# EAGLE schematic Module_BaseBoard (EAGLE 9.2.1)

## Sheet 1 of 5: CM5 MODULE
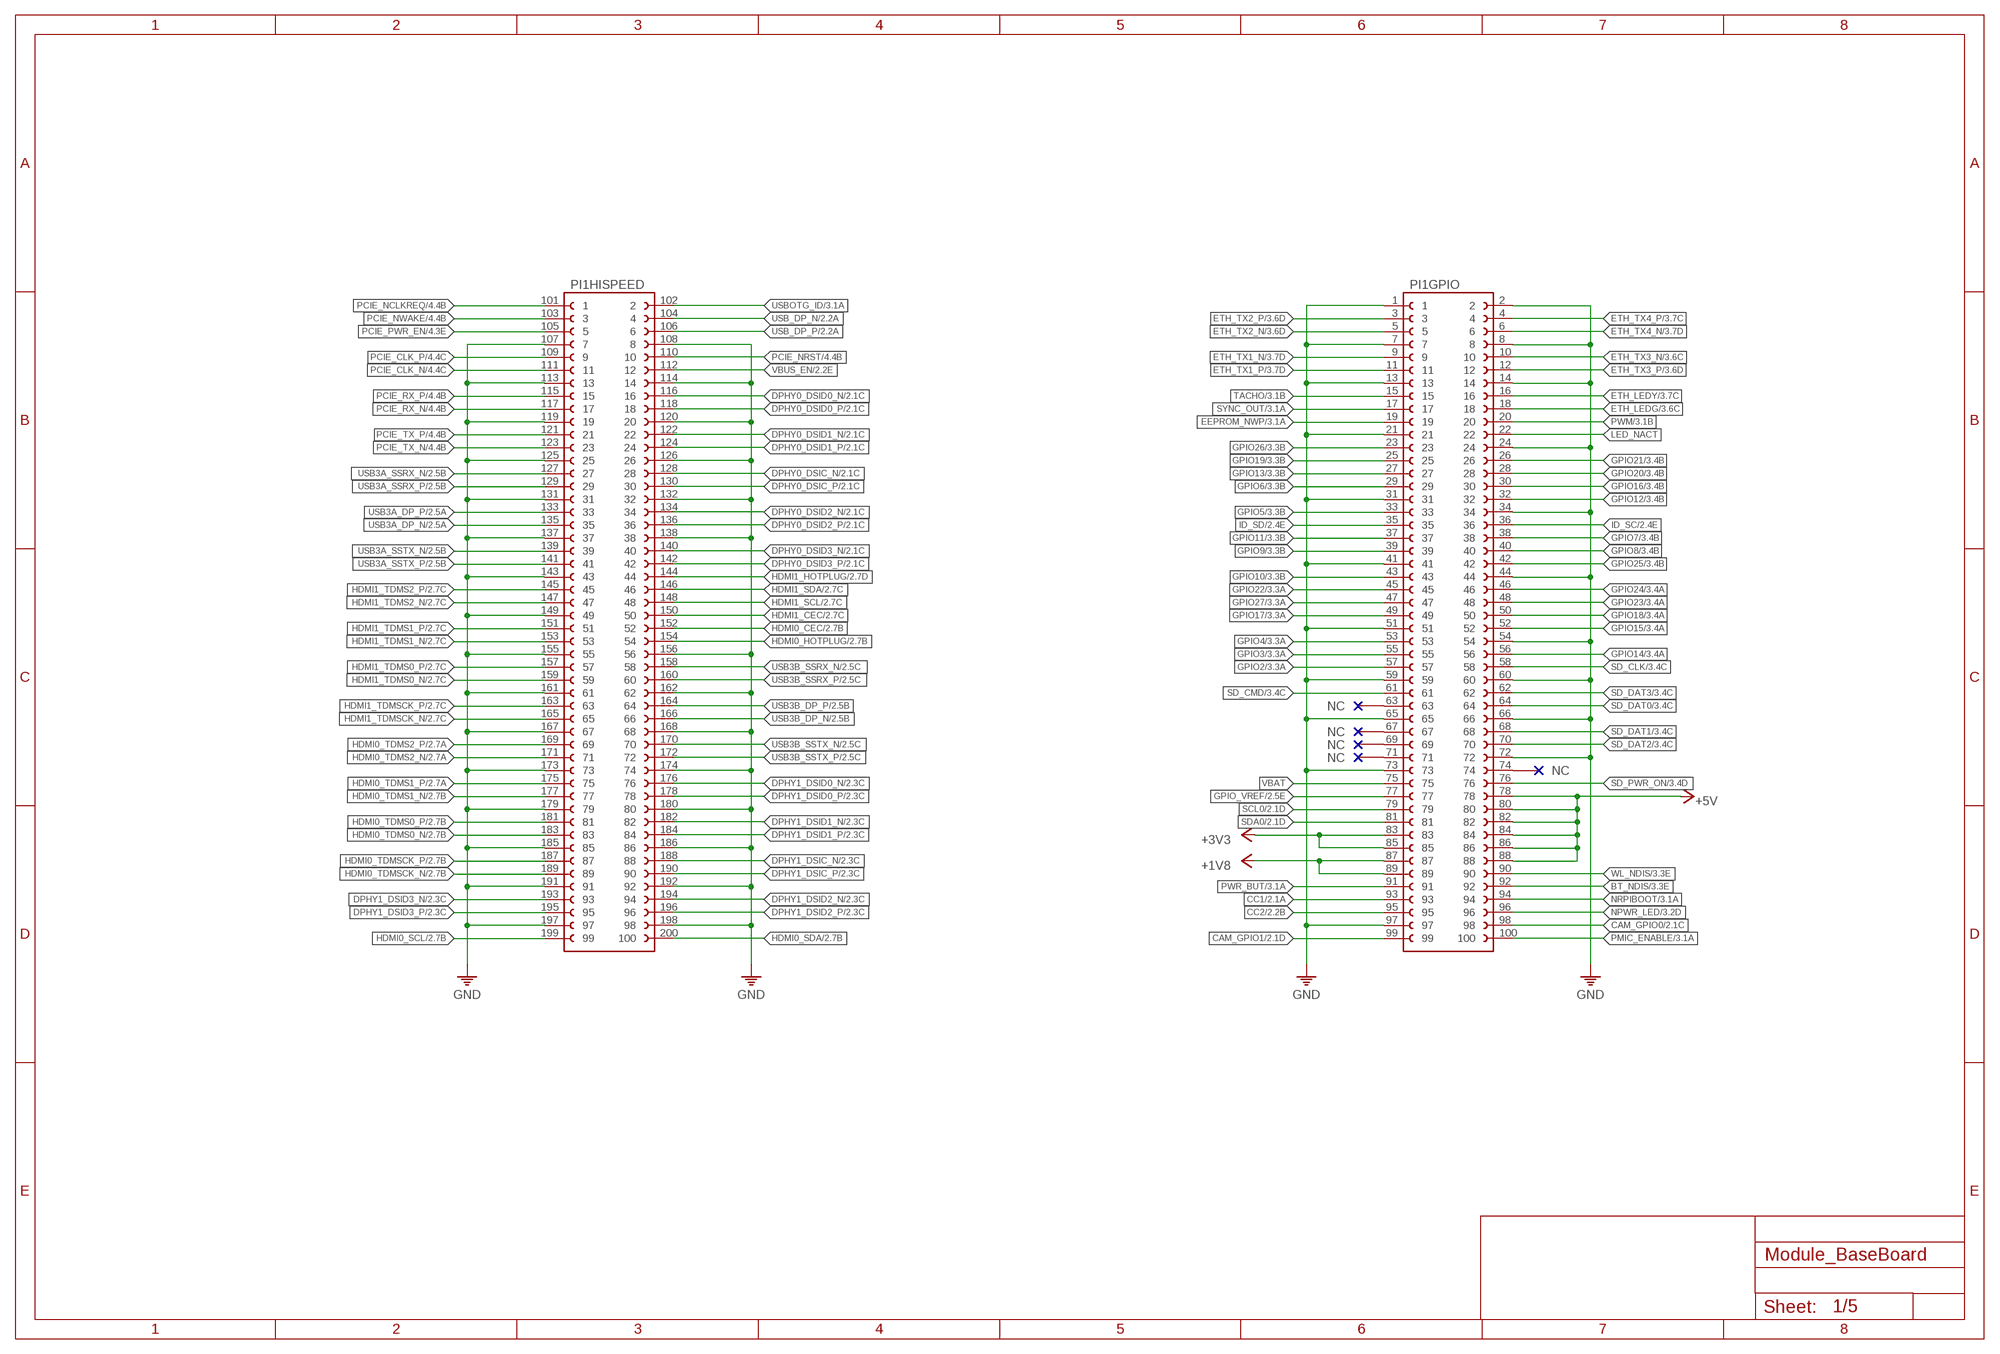
[diagram p0: schematic, sheet 1]

### Parts
PI1  RASPBERRY_CM5  [CM5]

### Nets
+1V8: PI1.87 PI1.89 ; also sheet 3
+3V3: PI1.83 PI1.85 ; also sheet 2,3,4,5
+5V: PI1.78 PI1.80 PI1.82 PI1.84 PI1.86 PI1.88 ; also sheet 2,3,4,5
BT_NDIS: PI1.92 ; also sheet 3
CAM_GPIO0: PI1.98 ; also sheet 2
CAM_GPIO1: PI1.99 ; also sheet 2
CC1: PI1.93 ; also sheet 2
CC2: PI1.95 ; also sheet 2
DPHY0_DSIC_N [100R_DIFFPAIR]: PI1.128 ; also sheet 2
DPHY0_DSIC_P [100R_DIFFPAIR]: PI1.130 ; also sheet 2
DPHY0_DSID0_N [100R_DIFFPAIR]: PI1.116 ; also sheet 2
DPHY0_DSID0_P [100R_DIFFPAIR]: PI1.118 ; also sheet 2
DPHY0_DSID1_N [100R_DIFFPAIR]: PI1.122 ; also sheet 2
DPHY0_DSID1_P [100R_DIFFPAIR]: PI1.124 ; also sheet 2
DPHY0_DSID2_N [100R_DIFFPAIR]: PI1.134 ; also sheet 2
DPHY0_DSID2_P [100R_DIFFPAIR]: PI1.136 ; also sheet 2
DPHY0_DSID3_N [100R_DIFFPAIR]: PI1.140 ; also sheet 2
DPHY0_DSID3_P [100R_DIFFPAIR]: PI1.142 ; also sheet 2
DPHY1_DSIC_N [100R_DIFFPAIR]: PI1.188 ; also sheet 2
DPHY1_DSIC_P [100R_DIFFPAIR]: PI1.190 ; also sheet 2
DPHY1_DSID0_N [100R_DIFFPAIR]: PI1.176 ; also sheet 2
DPHY1_DSID0_P [100R_DIFFPAIR]: PI1.178 ; also sheet 2
DPHY1_DSID1_N [100R_DIFFPAIR]: PI1.182 ; also sheet 2
DPHY1_DSID1_P [100R_DIFFPAIR]: PI1.184 ; also sheet 2
DPHY1_DSID2_N [100R_DIFFPAIR]: PI1.194 ; also sheet 2
DPHY1_DSID2_P [100R_DIFFPAIR]: PI1.196 ; also sheet 2
DPHY1_DSID3_N [100R_DIFFPAIR]: PI1.193 ; also sheet 2
DPHY1_DSID3_P [100R_DIFFPAIR]: PI1.195 ; also sheet 2
EEPROM_NWP: PI1.19 ; also sheet 3
ETH_LEDG: PI1.18 ; also sheet 3
ETH_LEDY: PI1.16 ; also sheet 3
ETH_TX1_N [100R_DIFFPAIR]: PI1.9 ; also sheet 3
ETH_TX1_P [100R_DIFFPAIR]: PI1.11 ; also sheet 3
ETH_TX2_N [100R_DIFFPAIR]: PI1.5 ; also sheet 3
ETH_TX2_P [100R_DIFFPAIR]: PI1.3 ; also sheet 3
ETH_TX3_N [100R_DIFFPAIR]: PI1.10 ; also sheet 3
ETH_TX3_P [100R_DIFFPAIR]: PI1.12 ; also sheet 3
ETH_TX4_N [100R_DIFFPAIR]: PI1.6 ; also sheet 3
ETH_TX4_P [100R_DIFFPAIR]: PI1.4 ; also sheet 3
GND: PI1.1 PI1.2 PI1.7 PI1.8 PI1.13 PI1.14 PI1.21 PI1.24 PI1.31 PI1.34 PI1.41 PI1.44 PI1.51 PI1.54 PI1.59 PI1.60 PI1.65 PI1.66 PI1.72 PI1.73 PI1.97 PI1.107 PI1.108 PI1.113 PI1.114 PI1.119 PI1.120 PI1.125 PI1.126 PI1.131 PI1.132 PI1.137 PI1.138 PI1.143 PI1.149 PI1.155 PI1.156 PI1.161 PI1.162 PI1.167 PI1.168 PI1.173 PI1.174 PI1.179 PI1.180 PI1.185 PI1.186 PI1.191 PI1.192 PI1.197 PI1.198 ; also sheet 2,3,4,5
GPIO2: PI1.57 ; also sheet 3,5
GPIO3: PI1.55 ; also sheet 3,5
GPIO4: PI1.53 ; also sheet 3,5
GPIO5: PI1.33 ; also sheet 3,5
GPIO6: PI1.29 ; also sheet 3,5
GPIO7: PI1.38 ; also sheet 3,5
GPIO8: PI1.40 ; also sheet 3,5
GPIO9: PI1.39 ; also sheet 3,5
GPIO10: PI1.43 ; also sheet 3,5
GPIO11: PI1.37 ; also sheet 3,5
GPIO12: PI1.32 ; also sheet 3,5
GPIO13: PI1.27 ; also sheet 3,5
GPIO14: PI1.56 ; also sheet 3,5
GPIO15: PI1.52 ; also sheet 3,5
GPIO16: PI1.30 ; also sheet 3,5
GPIO17: PI1.49 ; also sheet 3,5
GPIO18: PI1.50 ; also sheet 3,5
GPIO19: PI1.25 ; also sheet 3,5
GPIO20: PI1.28 ; also sheet 3,5
GPIO21: PI1.26 ; also sheet 3,5
GPIO22: PI1.45 ; also sheet 3,5
GPIO23: PI1.48 ; also sheet 3
GPIO24: PI1.46 ; also sheet 3,5
GPIO25: PI1.42 ; also sheet 3,5
GPIO26: PI1.23 ; also sheet 3,5
GPIO27: PI1.47 ; also sheet 3,5
GPIO_VREF: PI1.77 ; also sheet 2,3
HDMI0_CEC: PI1.152 ; also sheet 2
HDMI0_HOTPLUG: PI1.154 ; also sheet 2
HDMI0_SCL: PI1.199 ; also sheet 2
HDMI0_SDA: PI1.200 ; also sheet 2
HDMI0_TDMS0_N [100R_DIFFPAIR]: PI1.183 ; also sheet 2
HDMI0_TDMS0_P [100R_DIFFPAIR]: PI1.181 ; also sheet 2
HDMI0_TDMS1_N [100R_DIFFPAIR]: PI1.177 ; also sheet 2
HDMI0_TDMS1_P [100R_DIFFPAIR]: PI1.175 ; also sheet 2
HDMI0_TDMS2_N [100R_DIFFPAIR]: PI1.171 ; also sheet 2
HDMI0_TDMS2_P [100R_DIFFPAIR]: PI1.169 ; also sheet 2
HDMI0_TDMSCK_N [100R_DIFFPAIR]: PI1.189 ; also sheet 2
HDMI0_TDMSCK_P [100R_DIFFPAIR]: PI1.187 ; also sheet 2
HDMI1_CEC: PI1.150 ; also sheet 2
HDMI1_HOTPLUG: PI1.144 ; also sheet 2
HDMI1_SCL: PI1.148 ; also sheet 2
HDMI1_SDA: PI1.146 ; also sheet 2
HDMI1_TDMS0_N [100R_DIFFPAIR]: PI1.159 ; also sheet 2
HDMI1_TDMS0_P [100R_DIFFPAIR]: PI1.157 ; also sheet 2
HDMI1_TDMS1_N [100R_DIFFPAIR]: PI1.153 ; also sheet 2
HDMI1_TDMS1_P [100R_DIFFPAIR]: PI1.151 ; also sheet 2
HDMI1_TDMS2_N [100R_DIFFPAIR]: PI1.147 ; also sheet 2
HDMI1_TDMS2_P [100R_DIFFPAIR]: PI1.145 ; also sheet 2
HDMI1_TDMSCK_N [100R_DIFFPAIR]: PI1.165 ; also sheet 2
HDMI1_TDMSCK_P [100R_DIFFPAIR]: PI1.163 ; also sheet 2
ID_SC: PI1.36 ; also sheet 2,3
ID_SD: PI1.35 ; also sheet 2,3
LED_NACT: PI1.22
NPWR_LED: PI1.96 ; also sheet 3
NRPIBOOT: PI1.94 ; also sheet 3
PCIE_CLK_N [100R_DIFFPAIR]: PI1.111 ; also sheet 4
PCIE_CLK_P [100R_DIFFPAIR]: PI1.109 ; also sheet 4
PCIE_NCLKREQ: PI1.101 ; also sheet 4
PCIE_NRST: PI1.110 ; also sheet 4
PCIE_NWAKE: PI1.103 ; also sheet 4
PCIE_PWR_EN: PI1.105 ; also sheet 4
PCIE_RX_N [100R_DIFFPAIR]: PI1.117 ; also sheet 4
PCIE_RX_P [100R_DIFFPAIR]: PI1.115 ; also sheet 4
PCIE_TX_N [100R_DIFFPAIR]: PI1.123 ; also sheet 4
PCIE_TX_P [100R_DIFFPAIR]: PI1.121 ; also sheet 4
PMIC_ENABLE: PI1.100 ; also sheet 3
PWM: PI1.20 ; also sheet 3
PWR_BUT: PI1.91 ; also sheet 3
SCL0: PI1.79 ; also sheet 2
SD_CLK: PI1.58 ; also sheet 3
SD_CMD: PI1.61 ; also sheet 3
SD_DAT0: PI1.64 ; also sheet 3
SD_DAT1: PI1.68 ; also sheet 3
SD_DAT2: PI1.70 ; also sheet 3
SD_DAT3: PI1.62 ; also sheet 3
SD_PWR_ON: PI1.76 ; also sheet 3
SDA0: PI1.81 ; also sheet 2
SYNC_OUT: PI1.17 ; also sheet 3
TACHO: PI1.15 ; also sheet 3
USB3A_DP_N [90R_DIFFPAIR]: PI1.135 ; also sheet 2
USB3A_DP_P [90R_DIFFPAIR]: PI1.133 ; also sheet 2
USB3A_SSRX_N [90R_DIFFPAIR]: PI1.127 ; also sheet 2
USB3A_SSRX_P [90R_DIFFPAIR]: PI1.129 ; also sheet 2
USB3A_SSTX_N [90R_DIFFPAIR]: PI1.139 ; also sheet 2
USB3A_SSTX_P [90R_DIFFPAIR]: PI1.141 ; also sheet 2
USB3B_DP_N [90R_DIFFPAIR]: PI1.166 ; also sheet 2
USB3B_DP_P [90R_DIFFPAIR]: PI1.164 ; also sheet 2
USB3B_SSRX_N [90R_DIFFPAIR]: PI1.158 ; also sheet 2
USB3B_SSRX_P [90R_DIFFPAIR]: PI1.160 ; also sheet 2
USB3B_SSTX_N [90R_DIFFPAIR]: PI1.170 ; also sheet 2
USB3B_SSTX_P [90R_DIFFPAIR]: PI1.172 ; also sheet 2
USB_DP_N [90R_DIFFPAIR]: PI1.104 ; also sheet 2
USB_DP_P [90R_DIFFPAIR]: PI1.106 ; also sheet 2
USBOTG_ID: PI1.102 ; also sheet 3
VBAT: PI1.75
VBUS_EN: PI1.112 ; also sheet 2
WL_NDIS: PI1.90 ; also sheet 3
Unconnected: PI1.63 PI1.67 PI1.69 PI1.71 PI1.74

## Sheet 2 of 5: CM5 HIGH SPEED INTERFACES
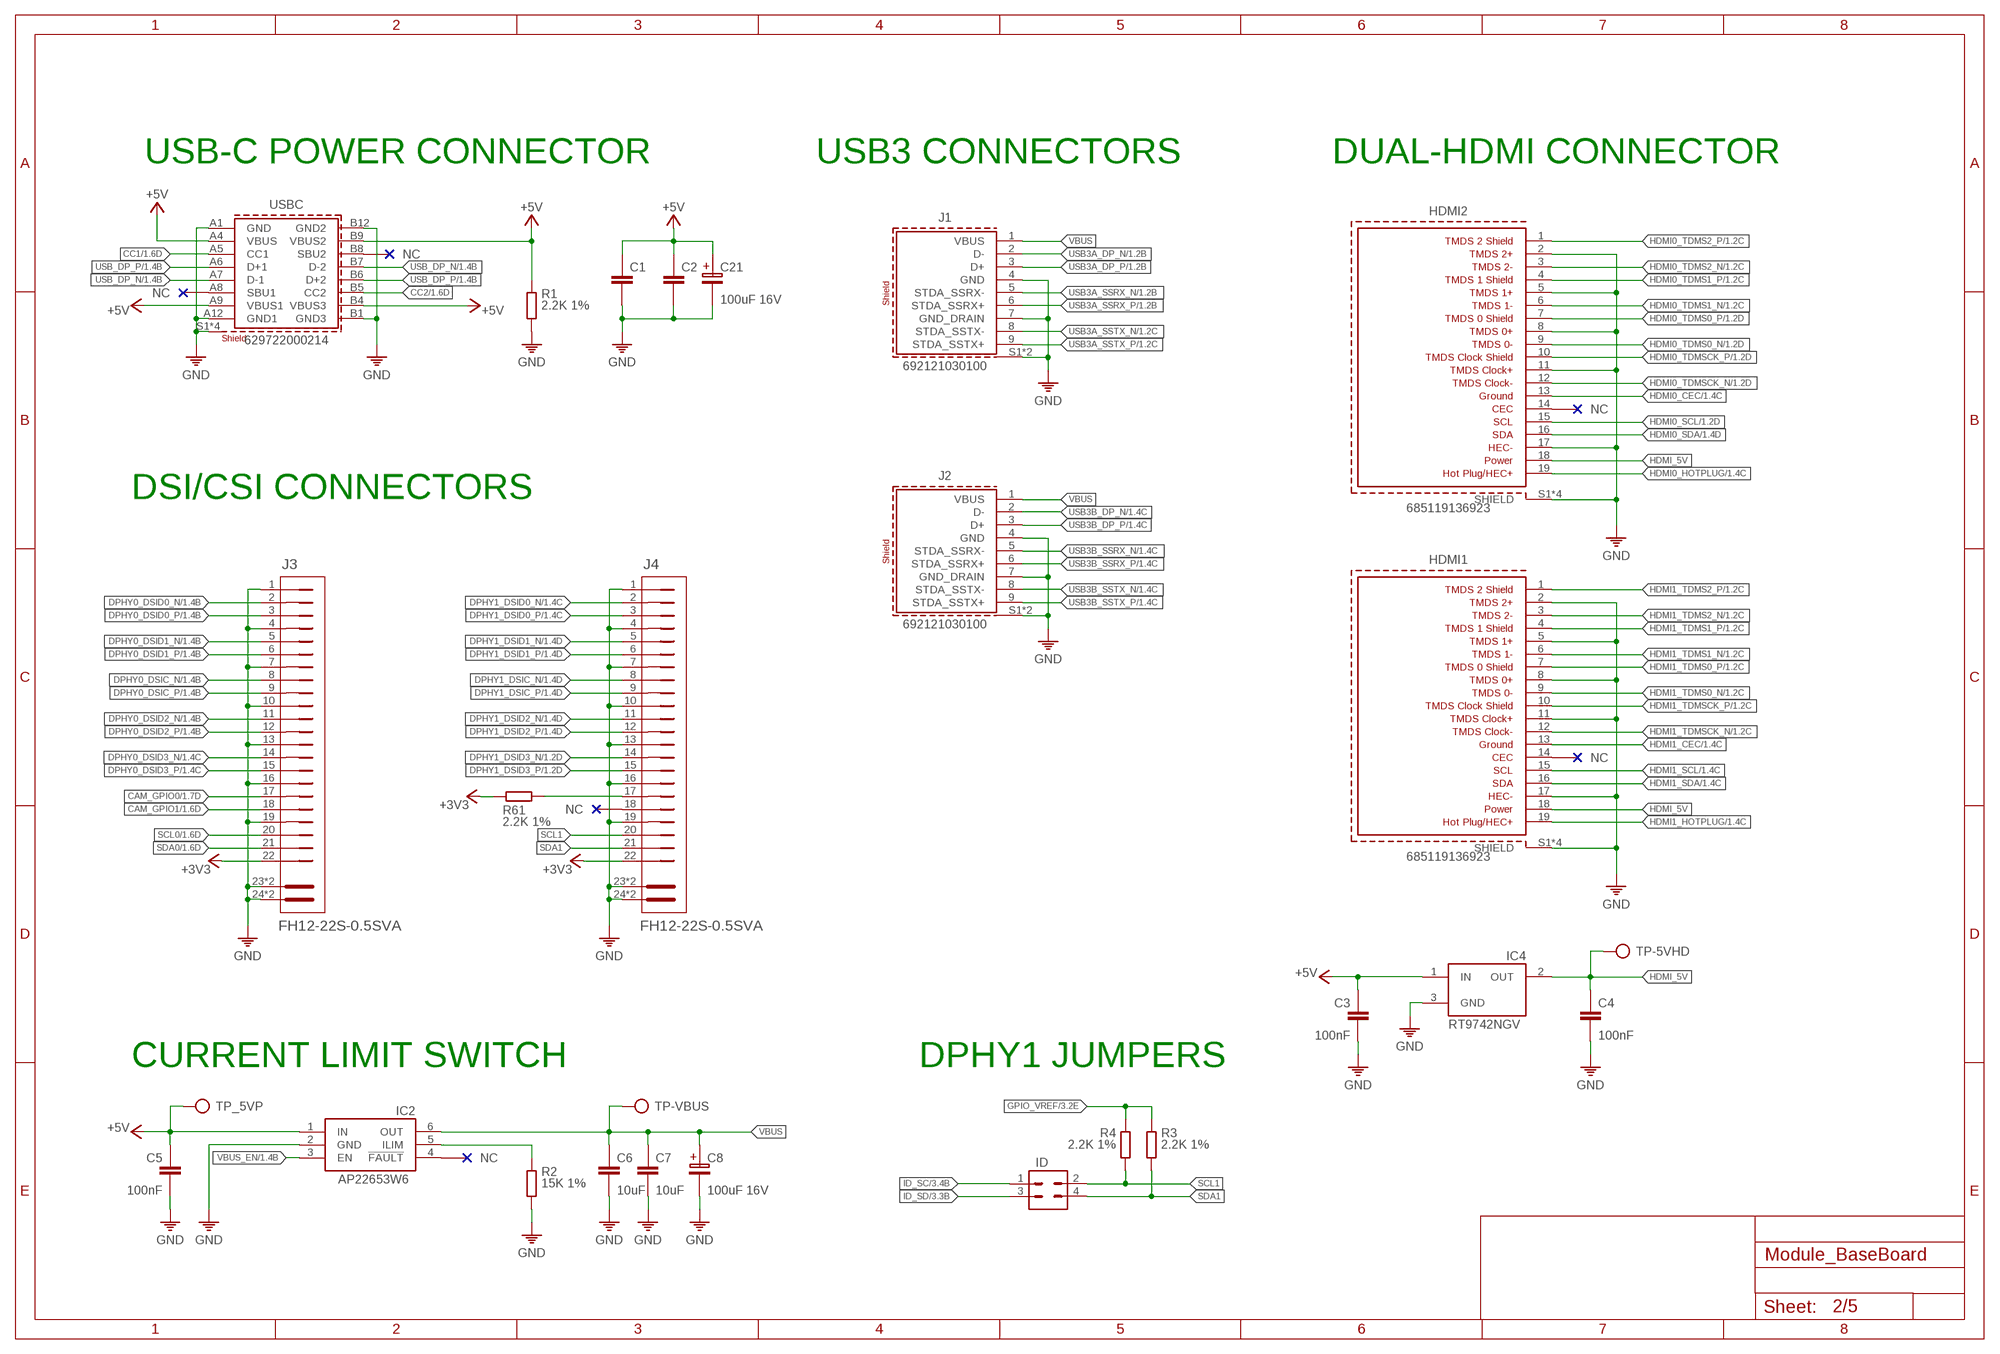
[diagram p1: schematic, sheet 2]

### Parts
C1  C-0402  [C0402]
C2  C-0402  [C0402]
C3  100nF  C-0402  [C0402]
C4  100nF  C-0402  [C0402]
C5  100nF  C-0402  [C0402]
C6  10uF  C-0805  [C0805]
C7  10uF  C-0805  [C0805]
C8  100uF 16V  CPOL  [100UF-16V]
C21  100uF 16V  CPOL  [100UF-16V]
HDMI1  685119136923  [685119136923]
HDMI2  685119136923  [685119136923]
IC2  AP22653W6  [SOT23-6]
IC4  RT9742NGV  [SOT23]
ID  CON-2X2  [2X2]
J1  692121030100  [692121030100]
J2  692121030100  [692121030100]
J3  FH12-22S-0.5SVA  [FH12-22S-0.5SH]
J4  FH12-22S-0.5SVA  [FH12-22S-0.5SH]
R1  2.2K 1%  R0402  [0402]
R2  15K 1%  R0402  [0402]
R3  2.2K 1%  R0402  [0402]
R4  2.2K 1%  R0402  [0402]
R61  2.2K 1%  R0402  [0402]
TP-5VHD  TP  [TP]
TP-VBUS  TP  [TP]
TP_5VP  TP  [TP]
USBC  629722000214  [629722000214]

### Nets
+3V3: J3.22 J4.22 R61.2 ; also sheet 1,3,4,5
+5V: C1.1 C2.1 C3.1 C5.1 C21.1 IC2.1(IN) IC4.1(IN) R1.1 TP_5VP.TP USBC.A4(VBUS) USBC.A9(VBUS1) USBC.B4(VBUS3) USBC.B9(VBUS2) ; also sheet 1,3,4,5
CAM_GPIO0: J3.17 ; also sheet 1
CAM_GPIO1: J3.18 ; also sheet 1
CC1: USBC.A5(CC1) ; also sheet 1
CC2: USBC.B5(CC2) ; also sheet 1
DPHY0_DSIC_N [100R_DIFFPAIR]: J3.8 ; also sheet 1
DPHY0_DSIC_P [100R_DIFFPAIR]: J3.9 ; also sheet 1
DPHY0_DSID0_N [100R_DIFFPAIR]: J3.2 ; also sheet 1
DPHY0_DSID0_P [100R_DIFFPAIR]: J3.3 ; also sheet 1
DPHY0_DSID1_N [100R_DIFFPAIR]: J3.5 ; also sheet 1
DPHY0_DSID1_P [100R_DIFFPAIR]: J3.6 ; also sheet 1
DPHY0_DSID2_N [100R_DIFFPAIR]: J3.11 ; also sheet 1
DPHY0_DSID2_P [100R_DIFFPAIR]: J3.12 ; also sheet 1
DPHY0_DSID3_N [100R_DIFFPAIR]: J3.14 ; also sheet 1
DPHY0_DSID3_P [100R_DIFFPAIR]: J3.15 ; also sheet 1
DPHY1_DSIC_N [100R_DIFFPAIR]: J4.8 ; also sheet 1
DPHY1_DSIC_P [100R_DIFFPAIR]: J4.9 ; also sheet 1
DPHY1_DSID0_N [100R_DIFFPAIR]: J4.2 ; also sheet 1
DPHY1_DSID0_P [100R_DIFFPAIR]: J4.3 ; also sheet 1
DPHY1_DSID1_N [100R_DIFFPAIR]: J4.5 ; also sheet 1
DPHY1_DSID1_P [100R_DIFFPAIR]: J4.6 ; also sheet 1
DPHY1_DSID2_N [100R_DIFFPAIR]: J4.11 ; also sheet 1
DPHY1_DSID2_P [100R_DIFFPAIR]: J4.12 ; also sheet 1
DPHY1_DSID3_N [100R_DIFFPAIR]: J4.14 ; also sheet 1
DPHY1_DSID3_P [100R_DIFFPAIR]: J4.15 ; also sheet 1
GND: C1.2 C2.2 C3.2 C4.2 C5.2 C6.2 C7.2 C8.2 C21.2 HDMI1.2(TMDS2+) HDMI1.5(TMDSDATA1+) HDMI1.8(TMDS0+) HDMI1.11(TMDSCLOCK+) HDMI1.17(UTILITY/HEAC+) HDMI1.S1(SHIELD) HDMI1.S2(SHIELD) HDMI1.S3(SHIELD) HDMI1.S4(SHIELD) HDMI2.2(TMDS2+) HDMI2.5(TMDSDATA1+) HDMI2.8(TMDS0+) HDMI2.11(TMDSCLOCK+) HDMI2.17(UTILITY/HEAC+) HDMI2.S1(SHIELD) HDMI2.S2(SHIELD) HDMI2.S3(SHIELD) HDMI2.S4(SHIELD) IC2.2(GND) IC4.3(GND) J1.4(GND) J1.7(GND_DRAIN) J1.S1(SHIELD) J1.S2(SHIELD) J2.4(GND) J2.7(GND_DRAIN) J2.S1(SHIELD) J2.S2(SHIELD) J3.1 J3.4 J3.7 J3.10 J3.13 J3.16 J3.19 J3.23(MH1) J3.24(MH2) J3.25(MH1) J3.26(MH2) J4.1 J4.4 J4.7 J4.10 J4.13 J4.16 J4.19 J4.23(MH1) J4.24(MH2) J4.25(MH1) J4.26(MH2) R1.2 R2.2 USBC.A1(GND) USBC.A12(GND1) USBC.B1(GND3) USBC.B12(GND2) USBC.S1(SHIELD) USBC.S2(SHIELD) USBC.S3(SHIELD) USBC.S4(SHIELD) ; also sheet 1,3,4,5
GPIO_VREF: R3.1 R4.1 ; also sheet 1,3
HDMI0_CEC: HDMI2.13(GROUND) ; also sheet 1
HDMI0_HOTPLUG: HDMI2.19(HOTPLUG/HEC+) ; also sheet 1
HDMI0_SCL: HDMI2.15(SCL) ; also sheet 1
HDMI0_SDA: HDMI2.16(SDA) ; also sheet 1
HDMI0_TDMS0_N [100R_DIFFPAIR]: HDMI2.9(TMDS0-) ; also sheet 1
HDMI0_TDMS0_P [100R_DIFFPAIR]: HDMI2.7(TMDS0SHIELD) ; also sheet 1
HDMI0_TDMS1_N [100R_DIFFPAIR]: HDMI2.6(TMDS1-) ; also sheet 1
HDMI0_TDMS1_P [100R_DIFFPAIR]: HDMI2.4(TMDS1SHIELD) ; also sheet 1
HDMI0_TDMS2_N [100R_DIFFPAIR]: HDMI2.3(TMDS2-) ; also sheet 1
HDMI0_TDMS2_P [100R_DIFFPAIR]: HDMI2.1(TMDS2SHIELD) ; also sheet 1
HDMI0_TDMSCK_N [100R_DIFFPAIR]: HDMI2.12(TMDSCLOCK-) ; also sheet 1
HDMI0_TDMSCK_P [100R_DIFFPAIR]: HDMI2.10(TMDSCLOCKSHIELD) ; also sheet 1
HDMI1_CEC: HDMI1.13(GROUND) ; also sheet 1
HDMI1_HOTPLUG: HDMI1.19(HOTPLUG/HEC+) ; also sheet 1
HDMI1_SCL: HDMI1.15(SCL) ; also sheet 1
HDMI1_SDA: HDMI1.16(SDA) ; also sheet 1
HDMI1_TDMS0_N [100R_DIFFPAIR]: HDMI1.9(TMDS0-) ; also sheet 1
HDMI1_TDMS0_P [100R_DIFFPAIR]: HDMI1.7(TMDS0SHIELD) ; also sheet 1
HDMI1_TDMS1_N [100R_DIFFPAIR]: HDMI1.6(TMDS1-) ; also sheet 1
HDMI1_TDMS1_P [100R_DIFFPAIR]: HDMI1.4(TMDS1SHIELD) ; also sheet 1
HDMI1_TDMS2_N [100R_DIFFPAIR]: HDMI1.3(TMDS2-) ; also sheet 1
HDMI1_TDMS2_P [100R_DIFFPAIR]: HDMI1.1(TMDS2SHIELD) ; also sheet 1
HDMI1_TDMSCK_N [100R_DIFFPAIR]: HDMI1.12(TMDSCLOCK-) ; also sheet 1
HDMI1_TDMSCK_P [100R_DIFFPAIR]: HDMI1.10(TMDSCLOCKSHIELD) ; also sheet 1
HDMI_5V: C4.1 HDMI1.18(POWER) HDMI2.18(POWER) IC4.2(OUT) TP-5VHD.TP
ID_SC: ID.1 ; also sheet 1,3
ID_SD: ID.3 ; also sheet 1,3
N$1: IC2.5(ILIM) R2.1
N$45: J4.17 R61.1
SCL0: J3.20 ; also sheet 1
SCL1: ID.2 J4.20 R4.2
SDA0: J3.21 ; also sheet 1
SDA1: ID.4 J4.21 R3.2
USB3A_DP_N [90R_DIFFPAIR]: J1.2(D-) ; also sheet 1
USB3A_DP_P [90R_DIFFPAIR]: J1.3(D+) ; also sheet 1
USB3A_SSRX_N [90R_DIFFPAIR]: J1.5(STDA_SSRX-) ; also sheet 1
USB3A_SSRX_P [90R_DIFFPAIR]: J1.6(STDA_SSRX+) ; also sheet 1
USB3A_SSTX_N [90R_DIFFPAIR]: J1.8(STDA_SSTX-) ; also sheet 1
USB3A_SSTX_P [90R_DIFFPAIR]: J1.9(STDA_SSTX+) ; also sheet 1
USB3B_DP_N [90R_DIFFPAIR]: J2.2(D-) ; also sheet 1
USB3B_DP_P [90R_DIFFPAIR]: J2.3(D+) ; also sheet 1
USB3B_SSRX_N [90R_DIFFPAIR]: J2.5(STDA_SSRX-) ; also sheet 1
USB3B_SSRX_P [90R_DIFFPAIR]: J2.6(STDA_SSRX+) ; also sheet 1
USB3B_SSTX_N [90R_DIFFPAIR]: J2.8(STDA_SSTX-) ; also sheet 1
USB3B_SSTX_P [90R_DIFFPAIR]: J2.9(STDA_SSTX+) ; also sheet 1
USB_DP_N [90R_DIFFPAIR]: USBC.A7(D-1) USBC.B7(D-2) ; also sheet 1
USB_DP_P [90R_DIFFPAIR]: USBC.A6(D+1) USBC.B6(D+2) ; also sheet 1
VBUS: C6.1 C7.1 C8.1 IC2.6(OUT) J1.1(VBUS) J2.1(VBUS) TP-VBUS.TP
VBUS_EN: IC2.3(EN) ; also sheet 1
Unconnected: HDMI1.14(CEC) HDMI2.14(CEC) IC2.4(!FAULT) J4.18 USBC.A8(SBU1) USBC.B8(SBU2)

### Notes on the sheet
- USB-C POWER CONNECTOR | USB3 CONNECTORS | DUAL-HDMI CONNECTOR
- DSI/CSI CONNECTORS
- CURRENT LIMIT SWITCH | DPHY1 JUMPERS

## Sheet 3 of 5: CM5 GPIO INTERFACES, ETHERNET
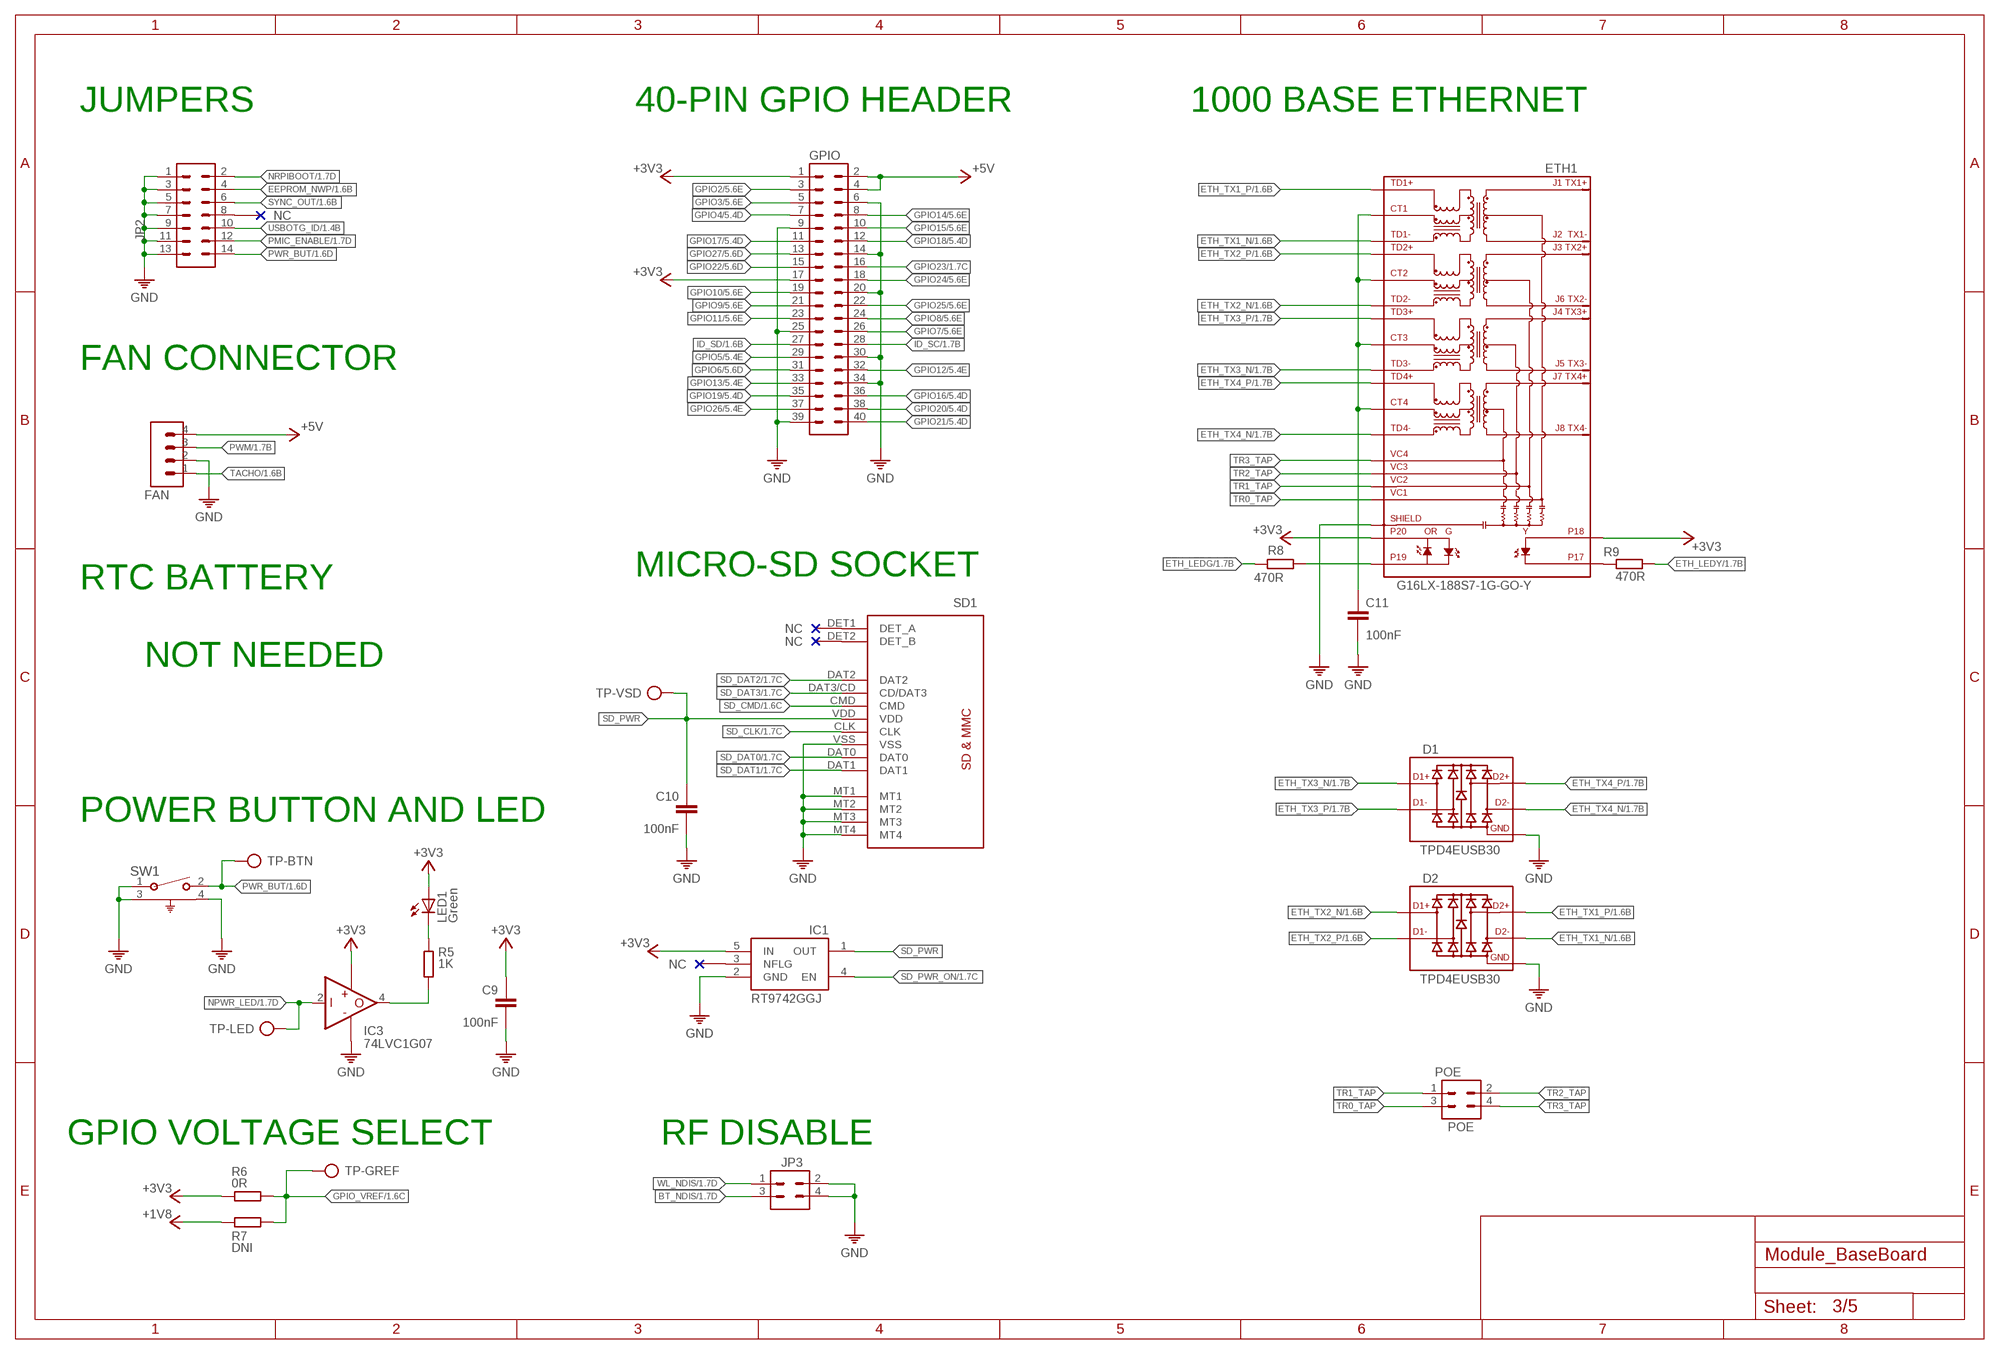
[diagram p2: schematic, sheet 3]

### Parts
C9  100nF  C-0402  [C0402]
C10  100nF  C-0402  [C0402]
C11  100nF  C-0402  [C0402]
D1  TPD4EUSB30  [USON]
D2  TPD4EUSB30  [USON]
ETH1  G16LX-188S7-1G-GO-Y  MAGJACK-POE  [MAGJACK_POE]
FAN  CON-1X4  [1X4]
GPIO  CON-2X20  [2X20]
IC1  RT9742GGJ  RT9742GGJ5  [SOT23-5]
IC3  74LVC1G07  [SOT23-5]
JP2  CON-2X7  [2X7]
JP3  CON-2X2  [2X2]
LED1  Green  LEDCHIPLED_0805  [CHIPLED_0805]
POE  POE  CON-2X2  [2X2]
R5  1K  R0402  [0402]
R6  0R  R0402  [0402]
R7  DNI  R0402  [0402]
R8  470R  R0402  [0402]
R9  470R  R0402  [0402]
SD1  MICRO-SD  [MICROSD]
SW1  1825027-8  [SW2_1825027-C_TEC]
TP-BTN  TP  [TP]
TP-GREF  TP  [TP]
TP-LED  TP  [TP]
TP-VSD  TP  [TP]

### Nets
+1V8: R7.1 ; also sheet 1
+3V3: C9.1 ETH1.18 ETH1.20 GPIO.1 GPIO.17 IC1.5(IN) IC3.5(VCC) LED1.A R6.1 ; also sheet 1,2,4,5
+5V: FAN.4 GPIO.2 GPIO.4 ; also sheet 1,2,4,5
BT_NDIS: JP3.3 ; also sheet 1
EEPROM_NWP: JP2.4 ; also sheet 1
ETH_LEDG: R8.1 ; also sheet 1
ETH_LEDY: R9.2 ; also sheet 1
ETH_TX1_N [100R_DIFFPAIR]: D2.2(D1-) D2.9(D1-) ETH1.TD1- ; also sheet 1
ETH_TX1_P [100R_DIFFPAIR]: D2.1(D1+) D2.10(D1+) ETH1.TD1+ ; also sheet 1
ETH_TX2_N [100R_DIFFPAIR]: D2.4(D2+) D2.7(D2+) ETH1.TD2- ; also sheet 1
ETH_TX2_P [100R_DIFFPAIR]: D2.5(D2-) D2.6(D2-) ETH1.TD2+ ; also sheet 1
ETH_TX3_N [100R_DIFFPAIR]: D1.4(D2+) D1.7(D2+) ETH1.TD3- ; also sheet 1
ETH_TX3_P [100R_DIFFPAIR]: D1.5(D2-) D1.6(D2-) ETH1.TD3+ ; also sheet 1
ETH_TX4_N [100R_DIFFPAIR]: D1.2(D1-) D1.9(D1-) ETH1.TD4- ; also sheet 1
ETH_TX4_P [100R_DIFFPAIR]: D1.1(D1+) D1.10(D1+) ETH1.TD4+ ; also sheet 1
GND: C9.2 C10.2 C11.2 D1.3(GND) D1.8(GND) D2.3(GND) D2.8(GND) ETH1.MH3(SHIELD) ETH1.MH4(SHIELD) FAN.2 GPIO.6 GPIO.9 GPIO.14 GPIO.20 GPIO.25 GPIO.30 GPIO.34 GPIO.39 IC1.2(GND) IC3.3(GND) JP2.1 JP2.3 JP2.5 JP2.7 JP2.9 JP2.11 JP2.13 JP3.2 JP3.4 SD1.MT1 SD1.MT2 SD1.MT3 SD1.MT4 SD1.VSS SW1.1 SW1.3 SW1.4 ; also sheet 1,2,4,5
GPIO2: GPIO.3 ; also sheet 1,5
GPIO3: GPIO.5 ; also sheet 1,5
GPIO4: GPIO.7 ; also sheet 1,5
GPIO5: GPIO.29 ; also sheet 1,5
GPIO6: GPIO.31 ; also sheet 1,5
GPIO7: GPIO.26 ; also sheet 1,5
GPIO8: GPIO.24 ; also sheet 1,5
GPIO9: GPIO.21 ; also sheet 1,5
GPIO10: GPIO.19 ; also sheet 1,5
GPIO11: GPIO.23 ; also sheet 1,5
GPIO12: GPIO.32 ; also sheet 1,5
GPIO13: GPIO.33 ; also sheet 1,5
GPIO14: GPIO.8 ; also sheet 1,5
GPIO15: GPIO.10 ; also sheet 1,5
GPIO16: GPIO.36 ; also sheet 1,5
GPIO17: GPIO.11 ; also sheet 1,5
GPIO18: GPIO.12 ; also sheet 1,5
GPIO19: GPIO.35 ; also sheet 1,5
GPIO20: GPIO.38 ; also sheet 1,5
GPIO21: GPIO.40 ; also sheet 1,5
GPIO22: GPIO.15 ; also sheet 1,5
GPIO23: GPIO.16 ; also sheet 1
GPIO24: GPIO.18 ; also sheet 1,5
GPIO25: GPIO.22 ; also sheet 1,5
GPIO26: GPIO.37 ; also sheet 1,5
GPIO27: GPIO.13 ; also sheet 1,5
GPIO_VREF: R6.2 R7.2 TP-GREF.TP ; also sheet 1,2
ID_SC: GPIO.28 ; also sheet 1,2
ID_SD: GPIO.27 ; also sheet 1,2
N$2: LED1.C R5.1
N$3: IC3.4(Y) R5.2
N$4: C11.1 ETH1.CT1 ETH1.CT2 ETH1.CT3 ETH1.CT4
N$5: ETH1.17 R9.1
N$8: ETH1.19 R8.2
NPWR_LED: IC3.2(A) TP-LED.TP ; also sheet 1
NRPIBOOT: JP2.2 ; also sheet 1
PMIC_ENABLE: JP2.12 ; also sheet 1
PWM: FAN.3 ; also sheet 1
PWR_BUT: JP2.14 SW1.2 TP-BTN.TP ; also sheet 1
SD_CLK: SD1.CLK ; also sheet 1
SD_CMD: SD1.CMD ; also sheet 1
SD_DAT0: SD1.DAT0 ; also sheet 1
SD_DAT1: SD1.DAT1 ; also sheet 1
SD_DAT2: SD1.DAT2 ; also sheet 1
SD_DAT3: SD1.DAT3/CD(CD/DAT3) ; also sheet 1
SD_PWR: C10.1 IC1.1(OUT) SD1.VDD TP-VSD.TP
SD_PWR_ON: IC1.4(EN) ; also sheet 1
SYNC_OUT: JP2.6 ; also sheet 1
TACHO: FAN.1 ; also sheet 1
TR0_TAP: ETH1.VC1 POE.3
TR1_TAP: ETH1.VC2 POE.1
TR2_TAP: ETH1.VC3 POE.2
TR3_TAP: ETH1.VC4 POE.4
USBOTG_ID: JP2.10 ; also sheet 1
WL_NDIS: JP3.1 ; also sheet 1
Unconnected: IC1.3(NFLG) JP2.8 SD1.DET1(DET_A) SD1.DET2(DET_B)

### Notes on the sheet
- JUMPERS | 40-PIN GPIO HEADER | 1000 BASE ETHERNET
- FAN CONNECTOR
- MICRO-SD SOCKET
- RTC BATTERY
- NOT NEEDED
- POWER BUTTON AND LED
- GPIO VOLTAGE SELECT | RF DISABLE

## Sheet 4 of 5: CM5 PCIE-M2 INTERFACE
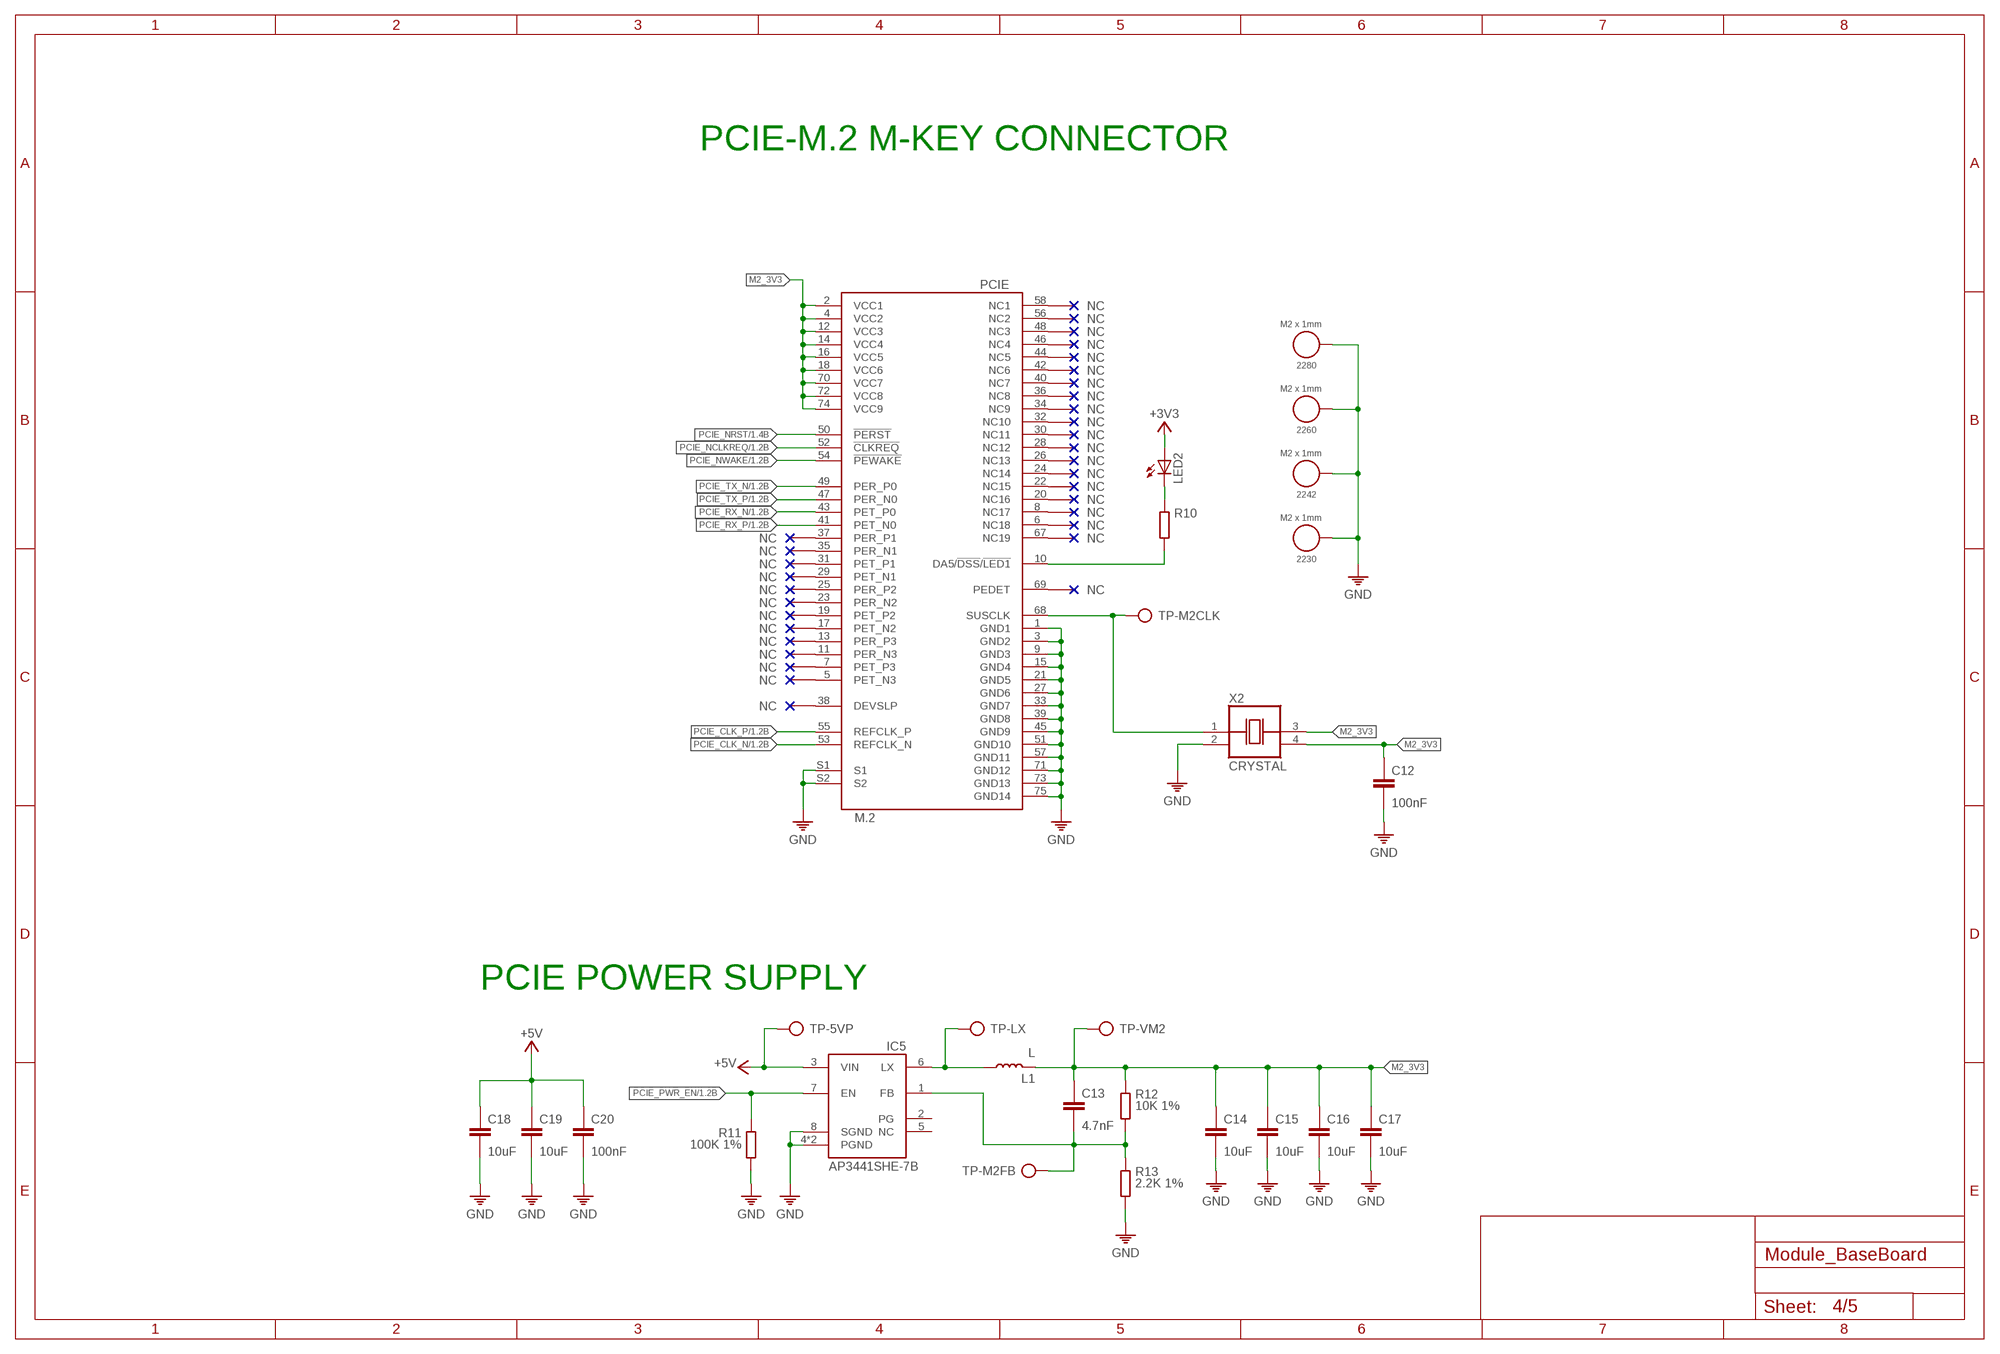
[diagram p3: schematic, sheet 4]

### Parts
2230  M2 x 1mm  WA-SMSI_9774XXX243_9774010243  [WA-SMSI_9774010243]
2242  M2 x 1mm  WA-SMSI_9774XXX243_9774010243  [WA-SMSI_9774010243]
2260  M2 x 1mm  WA-SMSI_9774XXX243_9774010243  [WA-SMSI_9774010243]
2280  M2 x 1mm  WA-SMSI_9774XXX243_9774010243  [WA-SMSI_9774010243]
C12  100nF  C-0402  [C0402]
C13  4.7nF  C-0402  [C0402]
C14  10uF  C-0805  [C0805]
C15  10uF  C-0805  [C0805]
C16  10uF  C-0805  [C0805]
C17  10uF  C-0805  [C0805]
C18  10uF  C-0805  [C0805]
C19  10uF  C-0805  [C0805]
C20  100nF  C-0402  [C0402]
IC5  AP3441SHE-7B  [SON50P201X201X56-9T90X170N]
L1  L  [SRR5228A]
LED2  LEDCHIPLED_0805  [CHIPLED_0805]
PCIE  M.2  [M.2]
R10  R0402  [0402]
R11  100K 1%  R0402  [0402]
R12  10K 1%  R0402  [0402]
R13  2.2K 1%  R0402  [0402]
TP-5VP  TP  [TP]
TP-LX  TP  [TP]
TP-M2CLK  TP  [TP]
TP-M2FB  TP  [TP]
TP-VM2  TP  [TP]
X2  CRYSTAL  [OSCCC500X320X130]

### Nets
+3V3: LED2.A ; also sheet 1,2,3,5
+5V: C18.1 C19.1 C20.1 IC5.3(VIN) TP-5VP.TP ; also sheet 1,2,3,5
GND: 2230.1 2242.1 2260.1 2280.1 C12.2 C14.2 C15.2 C16.2 C17.2 C18.2 C19.2 C20.2 IC5.4(PGND) IC5.8(SGND) IC5.9(PGND) PCIE.1(GND1) PCIE.3(GND2) PCIE.9(GND3) PCIE.15(GND4) PCIE.21(GND5) PCIE.27(GND6) PCIE.33(GND7) PCIE.39(GND8) PCIE.45(GND9) PCIE.51(GND10) PCIE.57(GND11) PCIE.71(GND12) PCIE.73(GND13) PCIE.75(GND14) PCIE.S1 PCIE.S2 R11.2 R13.2 X2.2(VSS) ; also sheet 1,2,3,5
M2_3V3: C12.1 C13.1 C14.1 C15.1 C16.1 C17.1 L1.2 PCIE.2(VCC1) PCIE.4(VCC2) PCIE.12(VCC3) PCIE.14(VCC4) PCIE.16(VCC5) PCIE.18(VCC6) PCIE.70(VCC7) PCIE.72(VCC8) PCIE.74(VCC9) R12.1 TP-VM2.TP X2.3(OUT) X2.4(VDD)
N$6: PCIE.10(DA5/!DSS!/!LED1) R10.2
N$7: LED2.C R10.1
N$9: IC5.6(LX) L1.1 TP-LX.TP
N$10: C13.2 IC5.1(FB) R12.2 R13.1 TP-M2FB.TP
N$11: PCIE.68(SUSCLK) TP-M2CLK.TP X2.1(CON)
PCIE_CLK_N [100R_DIFFPAIR]: PCIE.53(REFCLK_N) ; also sheet 1
PCIE_CLK_P [100R_DIFFPAIR]: PCIE.55(REFCLK_P) ; also sheet 1
PCIE_NCLKREQ: PCIE.52(!CLKREQ) ; also sheet 1
PCIE_NRST: PCIE.50(!PERST) ; also sheet 1
PCIE_NWAKE: PCIE.54(!PEWAKE) ; also sheet 1
PCIE_PWR_EN: IC5.7(EN) R11.1 ; also sheet 1
PCIE_RX_N [100R_DIFFPAIR]: PCIE.43(PET_P0) ; also sheet 1
PCIE_RX_P [100R_DIFFPAIR]: PCIE.41(PET_N0) ; also sheet 1
PCIE_TX_N [100R_DIFFPAIR]: PCIE.49(PER_P0) ; also sheet 1
PCIE_TX_P [100R_DIFFPAIR]: PCIE.47(PER_N0) ; also sheet 1
Unconnected: IC5.2(PG) IC5.5(NC) PCIE.5(PET_N3) PCIE.6(NC18) PCIE.7(PET_P3) PCIE.8(NC17) PCIE.11(PER_N3) PCIE.13(PER_P3) PCIE.17(PET_N2) PCIE.19(PET_P2) PCIE.20(NC16) PCIE.22(NC15) PCIE.23(PER_N2) PCIE.24(NC14) PCIE.25(PER_P2) PCIE.26(NC13) PCIE.28(NC12) PCIE.29(PET_N1) PCIE.30(NC11) PCIE.31(PET_P1) PCIE.32(NC10) PCIE.34(NC9) PCIE.35(PER_N1) PCIE.36(NC8) PCIE.37(PER_P1) PCIE.38(DEVSLP) PCIE.40(NC7) PCIE.42(NC6) PCIE.44(NC5) PCIE.46(NC4) PCIE.48(NC3) PCIE.56(NC2) PCIE.58(NC1) PCIE.67(NC19) PCIE.69(PEDET)

### Notes on the sheet
- PCIE-M.2 M-KEY CONNECTOR
- PCIE POWER SUPPLY

## Sheet 5 of 5
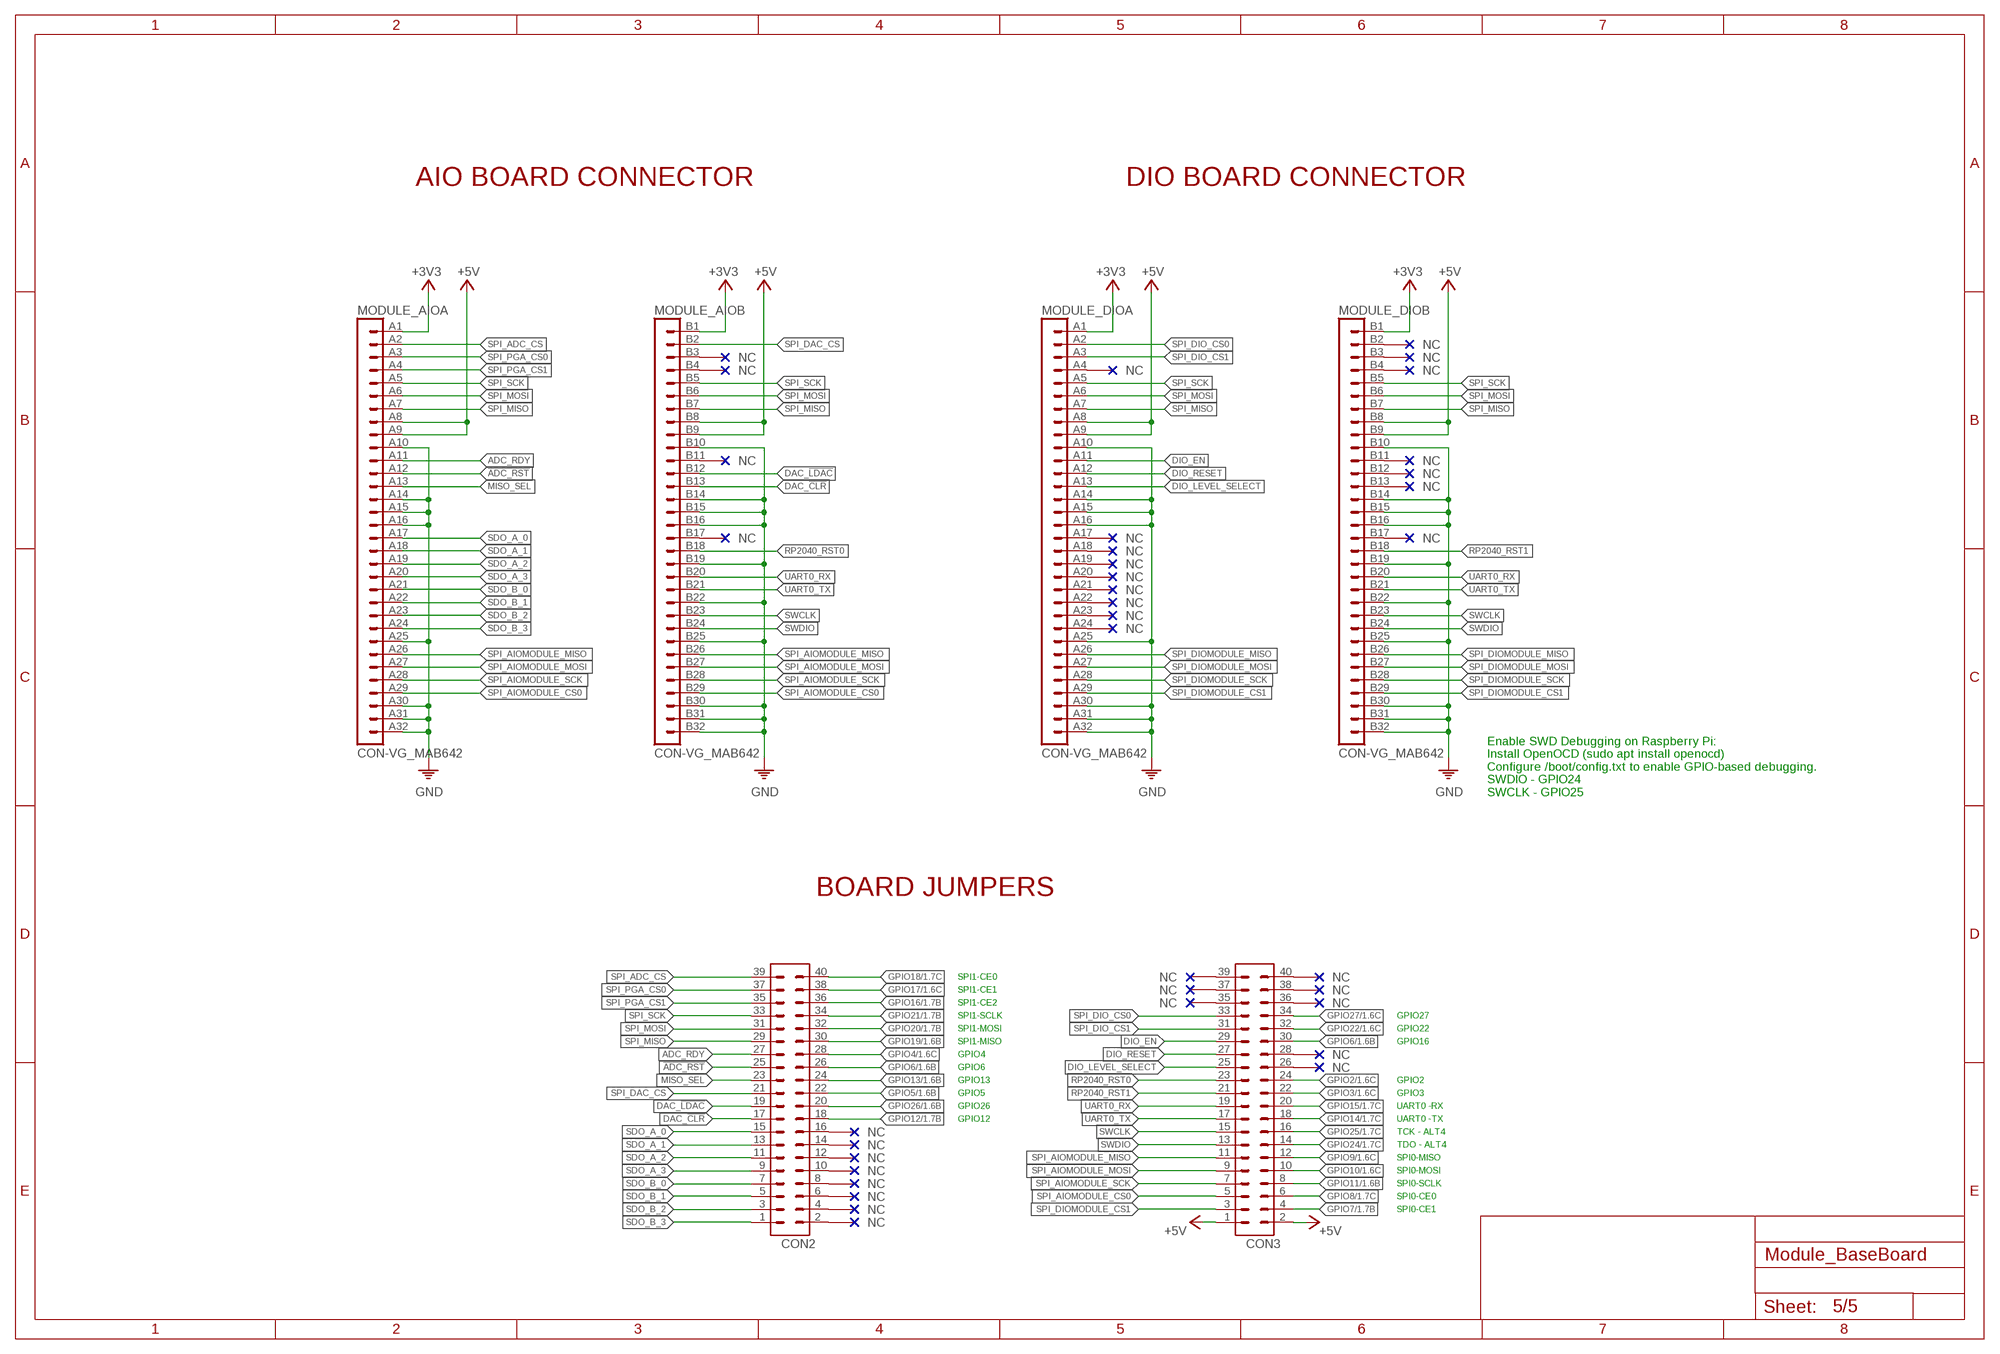
[diagram p4: schematic, sheet 5]

### Parts
CON2  CON-2X20  [2X20]
CON3  CON-2X20  [2X20]
MODULE_AIO  CON-VG_MAB642  [CON-VG-MAB64-RECEPTACLE]
MODULE_DIO  CON-VG_MAB642  [CON-VG-MAB64-RECEPTACLE]

### Nets
!ADC_RST: CON2.25 MODULE_AIO.A12
+3V3: MODULE_AIO.A1 MODULE_AIO.B1 MODULE_DIO.A1 MODULE_DIO.B1 ; also sheet 1,2,3,4
+5V: CON3.1 CON3.2 MODULE_AIO.A8 MODULE_AIO.A9 MODULE_AIO.B8 MODULE_AIO.B9 MODULE_DIO.A8 MODULE_DIO.A9 MODULE_DIO.B8 MODULE_DIO.B9 ; also sheet 1,2,3,4
ADC_RDY: CON2.27 MODULE_AIO.A11
DAC_!CLR: CON2.17 MODULE_AIO.B13
DAC_!LDAC: CON2.19 MODULE_AIO.B12
DIO_EN: CON3.29 MODULE_DIO.A11
DIO_LEVEL_SELECT: CON3.25 MODULE_DIO.A13
DIO_RESET: CON3.27 MODULE_DIO.A12
GND: MODULE_AIO.A10 MODULE_AIO.A14 MODULE_AIO.A15 MODULE_AIO.A16 MODULE_AIO.A25 MODULE_AIO.A30 MODULE_AIO.A31 MODULE_AIO.A32 MODULE_AIO.B10 MODULE_AIO.B14 MODULE_AIO.B15 MODULE_AIO.B16 MODULE_AIO.B19 MODULE_AIO.B22 MODULE_AIO.B25 MODULE_AIO.B30 MODULE_AIO.B31 MODULE_AIO.B32 MODULE_DIO.A10 MODULE_DIO.A14 MODULE_DIO.A15 MODULE_DIO.A16 MODULE_DIO.A25 MODULE_DIO.A30 MODULE_DIO.A31 MODULE_DIO.A32 MODULE_DIO.B10 MODULE_DIO.B14 MODULE_DIO.B15 MODULE_DIO.B16 MODULE_DIO.B19 MODULE_DIO.B22 MODULE_DIO.B25 MODULE_DIO.B30 MODULE_DIO.B31 MODULE_DIO.B32 ; also sheet 1,2,3,4
GPIO2: CON3.24 ; also sheet 1,3
GPIO3: CON3.22 ; also sheet 1,3
GPIO4: CON2.28 ; also sheet 1,3
GPIO5: CON2.22 ; also sheet 1,3
GPIO6: CON2.26 CON3.30 ; also sheet 1,3
GPIO7: CON3.4 ; also sheet 1,3
GPIO8: CON3.6 ; also sheet 1,3
GPIO9: CON3.12 ; also sheet 1,3
GPIO10: CON3.10 ; also sheet 1,3
GPIO11: CON3.8 ; also sheet 1,3
GPIO12: CON2.18 ; also sheet 1,3
GPIO13: CON2.24 ; also sheet 1,3
GPIO14: CON3.18 ; also sheet 1,3
GPIO15: CON3.20 ; also sheet 1,3
GPIO16: CON2.36 ; also sheet 1,3
GPIO17: CON2.38 ; also sheet 1,3
GPIO18: CON2.40 ; also sheet 1,3
GPIO19: CON2.30 ; also sheet 1,3
GPIO20: CON2.32 ; also sheet 1,3
GPIO21: CON2.34 ; also sheet 1,3
GPIO22: CON3.32 ; also sheet 1,3
GPIO24: CON3.14 ; also sheet 1,3
GPIO25: CON3.16 ; also sheet 1,3
GPIO26: CON2.20 ; also sheet 1,3
GPIO27: CON3.34 ; also sheet 1,3
MISO_SEL: CON2.23 MODULE_AIO.A13
RP2040_RST0: CON3.23 MODULE_AIO.B18
RP2040_RST1: CON3.21 MODULE_DIO.B18
SDO_A_0: CON2.15 MODULE_AIO.A17
SDO_A_1: CON2.13 MODULE_AIO.A18
SDO_A_2: CON2.11 MODULE_AIO.A19
SDO_A_3: CON2.9 MODULE_AIO.A20
SDO_B_0: CON2.7 MODULE_AIO.A21
SDO_B_1: CON2.5 MODULE_AIO.A22
SDO_B_2: CON2.3 MODULE_AIO.A23
SDO_B_3: CON2.1 MODULE_AIO.A24
SPI_ADC_CS: CON2.39 MODULE_AIO.A2
SPI_AIOMODULE_CS0: CON3.5 MODULE_AIO.A29 MODULE_AIO.B29
SPI_AIOMODULE_MISO: CON3.11 MODULE_AIO.A26 MODULE_AIO.B26
SPI_AIOMODULE_MOSI: CON3.9 MODULE_AIO.A27 MODULE_AIO.B27
SPI_AIOMODULE_SCK: CON3.7 MODULE_AIO.A28 MODULE_AIO.B28
SPI_DAC_CS: CON2.21 MODULE_AIO.B2
SPI_DIO_CS0: CON3.33 MODULE_DIO.A2
SPI_DIO_CS1: CON3.31 MODULE_DIO.A3
SPI_DIOMODULE_CS1: CON3.3 MODULE_DIO.A29 MODULE_DIO.B29
SPI_DIOMODULE_MISO: MODULE_DIO.A26 MODULE_DIO.B26
SPI_DIOMODULE_MOSI: MODULE_DIO.A27 MODULE_DIO.B27
SPI_DIOMODULE_SCK: MODULE_DIO.A28 MODULE_DIO.B28
SPI_MISO: CON2.29 MODULE_AIO.A7 MODULE_AIO.B7 MODULE_DIO.A7 MODULE_DIO.B7
SPI_MOSI: CON2.31 MODULE_AIO.A6 MODULE_AIO.B6 MODULE_DIO.A6 MODULE_DIO.B6
SPI_PGA_CS0: CON2.37 MODULE_AIO.A3
SPI_PGA_CS1: CON2.35 MODULE_AIO.A4
SPI_SCK: CON2.33 MODULE_AIO.A5 MODULE_AIO.B5 MODULE_DIO.A5 MODULE_DIO.B5
SWCLK: CON3.15 MODULE_AIO.B23 MODULE_DIO.B23
SWDIO: CON3.13 MODULE_AIO.B24 MODULE_DIO.B24
UART0_RX: CON3.19 MODULE_AIO.B20 MODULE_DIO.B20
UART0_TX: CON3.17 MODULE_AIO.B21 MODULE_DIO.B21
Unconnected: CON2.2 CON2.4 CON2.6 CON2.8 CON2.10 CON2.12 CON2.14 CON2.16 CON3.26 CON3.28 CON3.35 CON3.36 CON3.37 CON3.38 CON3.39 CON3.40 MODULE_AIO.B3 MODULE_AIO.B4 MODULE_AIO.B11 MODULE_AIO.B17 MODULE_DIO.A4 MODULE_DIO.A17 MODULE_DIO.A18 MODULE_DIO.A19 MODULE_DIO.A20 MODULE_DIO.A21 MODULE_DIO.A22 MODULE_DIO.A23 MODULE_DIO.A24 MODULE_DIO.B2 MODULE_DIO.B3 MODULE_DIO.B4 MODULE_DIO.B11 MODULE_DIO.B12 MODULE_DIO.B13 MODULE_DIO.B17

### Notes on the sheet
- AIO BOARD CONNECTOR | DIO BOARD CONNECTOR
- Enable SWD Debugging on Raspberry Pi:
  Install OpenOCD (sudo apt install openocd)
  Configure /boot/config.txt to enable GPIO-based debugging.
  SWDIO - GPIO24
  SWCLK - GPIO25
- BOARD JUMPERS
- SPI1-CE0
- SPI1-CE1
- SPI1-CE2
- SPI1-SCLK | GPIO27
- SPI1-MOSI | GPIO22
- SPI1-MISO | GPIO16
- GPIO4
- GPIO6
- GPIO13 | GPIO2
- GPIO5 | GPIO3
- GPIO26 | UART0 -RX
- GPIO12 | UART0 -TX
- TCK - ALT4
- TDO - ALT4
- SPI0-MISO
- SPI0-MOSI
- SPI0-SCLK
- SPI0-CE0
- SPI0-CE1

## Library data of the parts
2230 2242 2260 2280 = Wurth_Assembly_WA-SMSI:WA-SMSI_9774XXX243: WA-SMSI SMT Steel Spacer, M2 Thread Internal Applications Assembling of PCBs to housing and to other PCBs For Distances from 1 to 8 mm Fast and precise process Strong holding forces and torques Highest process reliability Instant removable Polyimide Tape Properties Material Steel Surface Tin Ti M2 Solder Paste Thickness 150 µm Tightening Torque (Value) 0.2 N*m General Information Operating Temperature -55 up to +150 °C <https://www.we-online.com/catalog/media/o92910v209%20Family_WA-SMSI_M2-M2.5.jpg> Details see: https://www.we-online.com/katalog/en/SMSI_SMT_STEEL_SPACER_M2_THREAD_INTERNAL Updated by Ella Wu 2020-06-03 2021(C) Wurth Elektronik; DATASHEET-URL: https://www.we-online.com/catalog/datasheet/9774010243.pdf; INNER-DIAMETER: 2.8mm; INNER-THREAD-LENGTH: -; OUTER-DIAMETER: 4.35mm; PART-NUMBER: 9774010243; PIN-LENGTH: 1mm; THREAD: M2
C1-C7 C9-C20 = ds_passive:C
C8 C21 = ds_passive:CPOL
CON2 CON3 GPIO = ds_con:CON-2X20
D1 D2 = ds_ic_peripherals:TPD4EUSB30: TPDxEUSB30 2-, 4-Channel ESD Protection for Super-Speed USB 3.0 Interface
ETH1 = ds_con:MAGJACK-POE: Right Angle 1G Mag Jack w/ POE Tab Up, Shielded w/ EMI Fingers, LEDs
FAN = ds_con:CON-1X4
HDMI1 HDMI2 = Wurth_Connectors_WR-HDMI:685119136923: WR-COM Mini HDMI SMT Horizontal <https://www.we-online.com/components/media/o33017v209%20Family_WR-COM_685119136923.jpg> Details see: www.we-online.com/en/components/products/COM_MINI_SMT_HORIZONTAL <www.we-online.com/catalog/COM_MINI_SMT_HORIZONTAL/?utm_source=eagle_model&utm_medium=description_link&utm_campaign=eisos_eagle> Updated by Ella Wu 2023-05-16 2023(C) Würth Elektronik; DATASHEET-URL: https://www.we-online.com/redexpert/spec/685119136923?ae; GERDER: Receptacle; MOUNT: SMT; PART-NUMBER: 685119136923; PINS: 19; RATED-CURRENT: 0.5A; TYPE: Horizontal; WORKING-VOLTAGE: 40VAC
IC1 = ds_ic_peripherals:RT9742GGJ5: 70mΩ/55mΩ, 3A/2.5A/2A/1.5A/1A/0.5A High-Side Power Switches with Flag
IC2 = ds_ic_peripherals:AP22653W6: PRECISION ADJUSTABLE CURRENT-LIMITED POWER SWITCHES
IC3 = ds_ic_logic:74LVC1G07: SINGLE BUFFER/DRIVER WITH OPEN DRAIN OUTPUT
IC4 = ds_ic_peripherals:RT9742: 70mΩ/55mΩ, 3A/2.5A/2A/1.5A/1A/0.5A High-Side Power Switches with Flag
IC5 = ds_ic_vreg:AP3441SHE-7B: 1MHZ, 3A STEP-DOWN DC-DC BUCK CONVERTER
ID JP3 POE = ds_con:CON-2X2
J1 J2 = Wurth_Connectors_WR-USB:692121030100: WR-COM USB 3.0 Type A Horizontal Kind Properties Durability:5 000 Mating cycles Quality Class:5 000 Mating cycles Connector Type:USB Gender:Receptacle Type:Horizontal General Information Operating Temperature:-20up to +85 °C Compliance:RoHS Electrical Properties IR 1:1.8A Working Voltage:30V (AC) Withstanding Voltage:100V (AC) Contact Resistance:50 mΩ Material Properties Insulator Material:LCP Insulator Flammability Rating:UL94 V-0 Color:Blue Contact Material:Phosphor Bronze Contact Plating:Matte Tin over Nickel Contact Type:Stamped Shielding Material:Brass Shielding Plating:Matte Tin <https://www.we-online.com/catalog/media/o33027v209%20Family_WR-COM_692121xxx100.jpg> Details see: https://www.we-online.com/catalog/en/COM_3_0_TYPE_A_HORIZONTAL/ Updated by Yingchun, Shan 2020-01-16 2020 (C) Würth Elektronik; APPLICATION: USB 3.0; DATASHEET-URL: https://www.we-online.com/redexpert/spec/692121030100?ae; GERDER: Receptacle; INTERFACE-TYPE: Type A; IR: 1.8A; MOUNT: THT; PACKAGING: Tape and Reel; PART-NUMBER: 692121030100; PINS: 9; TYPE: Horizontal; WORKING-VOLTAGE: 30V(AC)
J3 J4 = ds_con:FH12-22S-0.5SVA
JP2 = ds_con:CON-2X7
L1 = ds_passive:L
LED1 LED2 = led:LED: LED OSRAM: - CHIPLED LG R971, LG N971, LY N971, LG Q971, LY Q971, LO R971, LY R971 LH N974, LH R974 LS Q976, LO Q976, LY Q976 LO Q996 - Hyper CHIPLED LW Q18S LB Q993, LB Q99A, LB R99A - SideLED LS A670, LO A670, LY A670, LG A670, LP A670 LB A673, LV A673, LT A673, LW A673 LH A674 LY A675 LS A676, LA A676, LO A676, LY A676, LW A676 LS A679, LY A679, LG A679 - Hyper Micro SIDELED® LS Y876, LA Y876, LO Y876, LY Y876 LT Y87S - SmartLED LW L88C, LW L88S LB L89C, LB L89S, LG L890 LS L89K, LO L89K, LY L89K LS L896, LA L896, LO L896, LY L896 - TOPLED LS T670, LO T670, LY T670, LG T670, LP T670 LSG T670, LSP T670, LSY T670, LOP T670, LYG T670 LG T671, LOG T671, LSG T671 LB T673, LV T673, LT T673, LW T673 LH T674 LS T676, LA T676, LO T676, LY T676, LB T676, LH T676, LSB T676, LW T676 LB T67C, LV T67C, LT T67C, LS T67K, LO T67K, LY T67K, LW E67C LS E67B, LA E67B, LO E67B, LY E67B, LB E67C, LV E67C, LT E67C LW T67C LS T679, LY T679, LG T679 LS T770, LO T770, LY T770, LG T770, LP T770 LB T773, LV T773, LT T773, LW T773 LH T774 LS E675, LA E675, LY E675, LS T675 LS T776, LA T776, LO T776, LY T776, LB T776 LHGB T686 LT T68C, LB T68C - Hyper Mini TOPLED® LB M676 - Mini TOPLED Santana® LG M470 LS M47K, LO M47K, LY M47K Source: http://www.osram.convergy.de LUXEON: - LUMILED® LXK2-PW12-R00, LXK2-PW12-S00, LXK2-PW14-U00, LXK2-PW14-V00 LXK2-PM12-R00, LXK2-PM12-S00, LXK2-PM14-U00 LXK2-PE12-Q00, LXK2-PE12-R00, LXK2-PE12-S00, LXK2-PE14-T00, LXK2-PE14-U00 LXK2-PB12-K00, LXK2-PB12-L00, LXK2-PB12-M00, LXK2-PB14-N00, LXK2-PB14-P00, LXK2-PB14-Q00 LXK2-PR12-L00, LXK2-PR12-M00, LXK2-PR14-Q00, LXK2-PR14-R00 LXK2-PD12-Q00, LXK2-PD12-R00, LXK2-PD12-S00 LXK2-PH12-R00, LXK2-PH12-S00 LXK2-PL12-P00, LXK2-PL12-Q00, LXK2-PL12-R00 Source: www.luxeon.com KINGBRIGHT: KA-3528ASYC Source: www.kingbright.com
MODULE_AIO MODULE_DIO = ds_con:CON-VG_MAB64: CONNECTOR male, 94 pins, type B, rows AB, grid 2.54 mm
PCIE = ds_con:M.2: Card Edge Connector, Dual Side, 67 Contacts, Surface Mount, Right Angle, Solder
PI1 = ds_ic_peripherals:RASPBERRY_CM5
R1-R13 R61 = ds_passive:R
SD1 = ds_con:MICRO-SD
SW1 = ds_passive:1825027-8; COPYRIGHT: Copyright (C) 2025 Ultra Librarian. All rights reserved.; MANUFACTURER_PART_NUMBER: 1825027-8; MFR_NAME: TE Connectivity
TP-5VHD TP-5VP TP-BTN TP-GREF TP-LED TP-LX TP-M2CLK TP-M2FB TP-VBUS TP-VM2 TP-VSD TP_5VP = ds_passive:TP
USBC = Wurth_Connectors_WR-USB:629722000214: WR-COM USB 2.0 Type C Receptacle Horizontal SMT Kind Properties Durability 10 000 Mating cycles Gender Receptacle Type Horizontal General Information Operating Temperature -40 up to +85 °C Electrical Properties Working Voltage 20 V (DC) Withstanding Voltage 100 V (AC) Contact Resistance 40 mΩ Material Properties Insulator Material LCP Insulator Flammability Rating UL94 V-0 Insulator Color Black Contact Material Brass Contact Plating Gold over Nickel Contact Type Stamped Shielding Material Steel Shielding Plating Nickel (Ni) <https://www.we-online.com/components/media/o689297v209%20family-wr-com-629722000214.jpg> Details see: www.we-online.com/en/components/products/WR-COM_USB_20_TYPE_C_RECEPTACLE_HORIZONTAL_SMT <www.we-online.com/catalog/WR-COM_USB_20_TYPE_C_RECEPTACLE_HORIZONTAL_SMT/?utm_source=eagle_model&utm_medium=description_link&utm_campaign=eisos_eagle> Updated by Ella Wu 2023-05-30 2023 (C) Würth Elektronik; APPLICATION: USB 2.0; DATASHEET-URL: https://www.we-online.com/redexpert/spec/629722000214?ae; GERDER: Receptacle; INTERFACE-TYPE: Type C; IR: 5A; MOUNT: SMT; PACKAGING: Tape and Reel; PART-NUMBER: 629722000214; PINS: 16; TYPE: Horizontal; WORKING-VOLTAGE: 20V(AC)
X2 = ds_passive:CRYSTAL

## Net classes
0 default: width 0.16 mm, drill 0.15 mm, clearance 0.191 mm
1 50R_DIFFPAIR: width 0.4 mm, drill 0.15 mm, clearance 0.191 mm
2 90R_DIFFPAIR: width 0.155 mm, drill 0.15 mm, clearance 0.191 mm
3 100R_DIFFPAIR: width 0.121 mm, drill 0.15 mm, clearance 0.191 mm